# EasyEDA Pro project ProProject_Stc32f_Car副本_2024-06-03.epro, schematic 主板
Create Date: 2024-03-17; Page Name: 主板原理图; Project Name: Stc32f_Car; Schematic Name: 主板; Update Date: 2024-04-25; Company: 嘉立创EDA; Page Size: A4; Version: V1.0
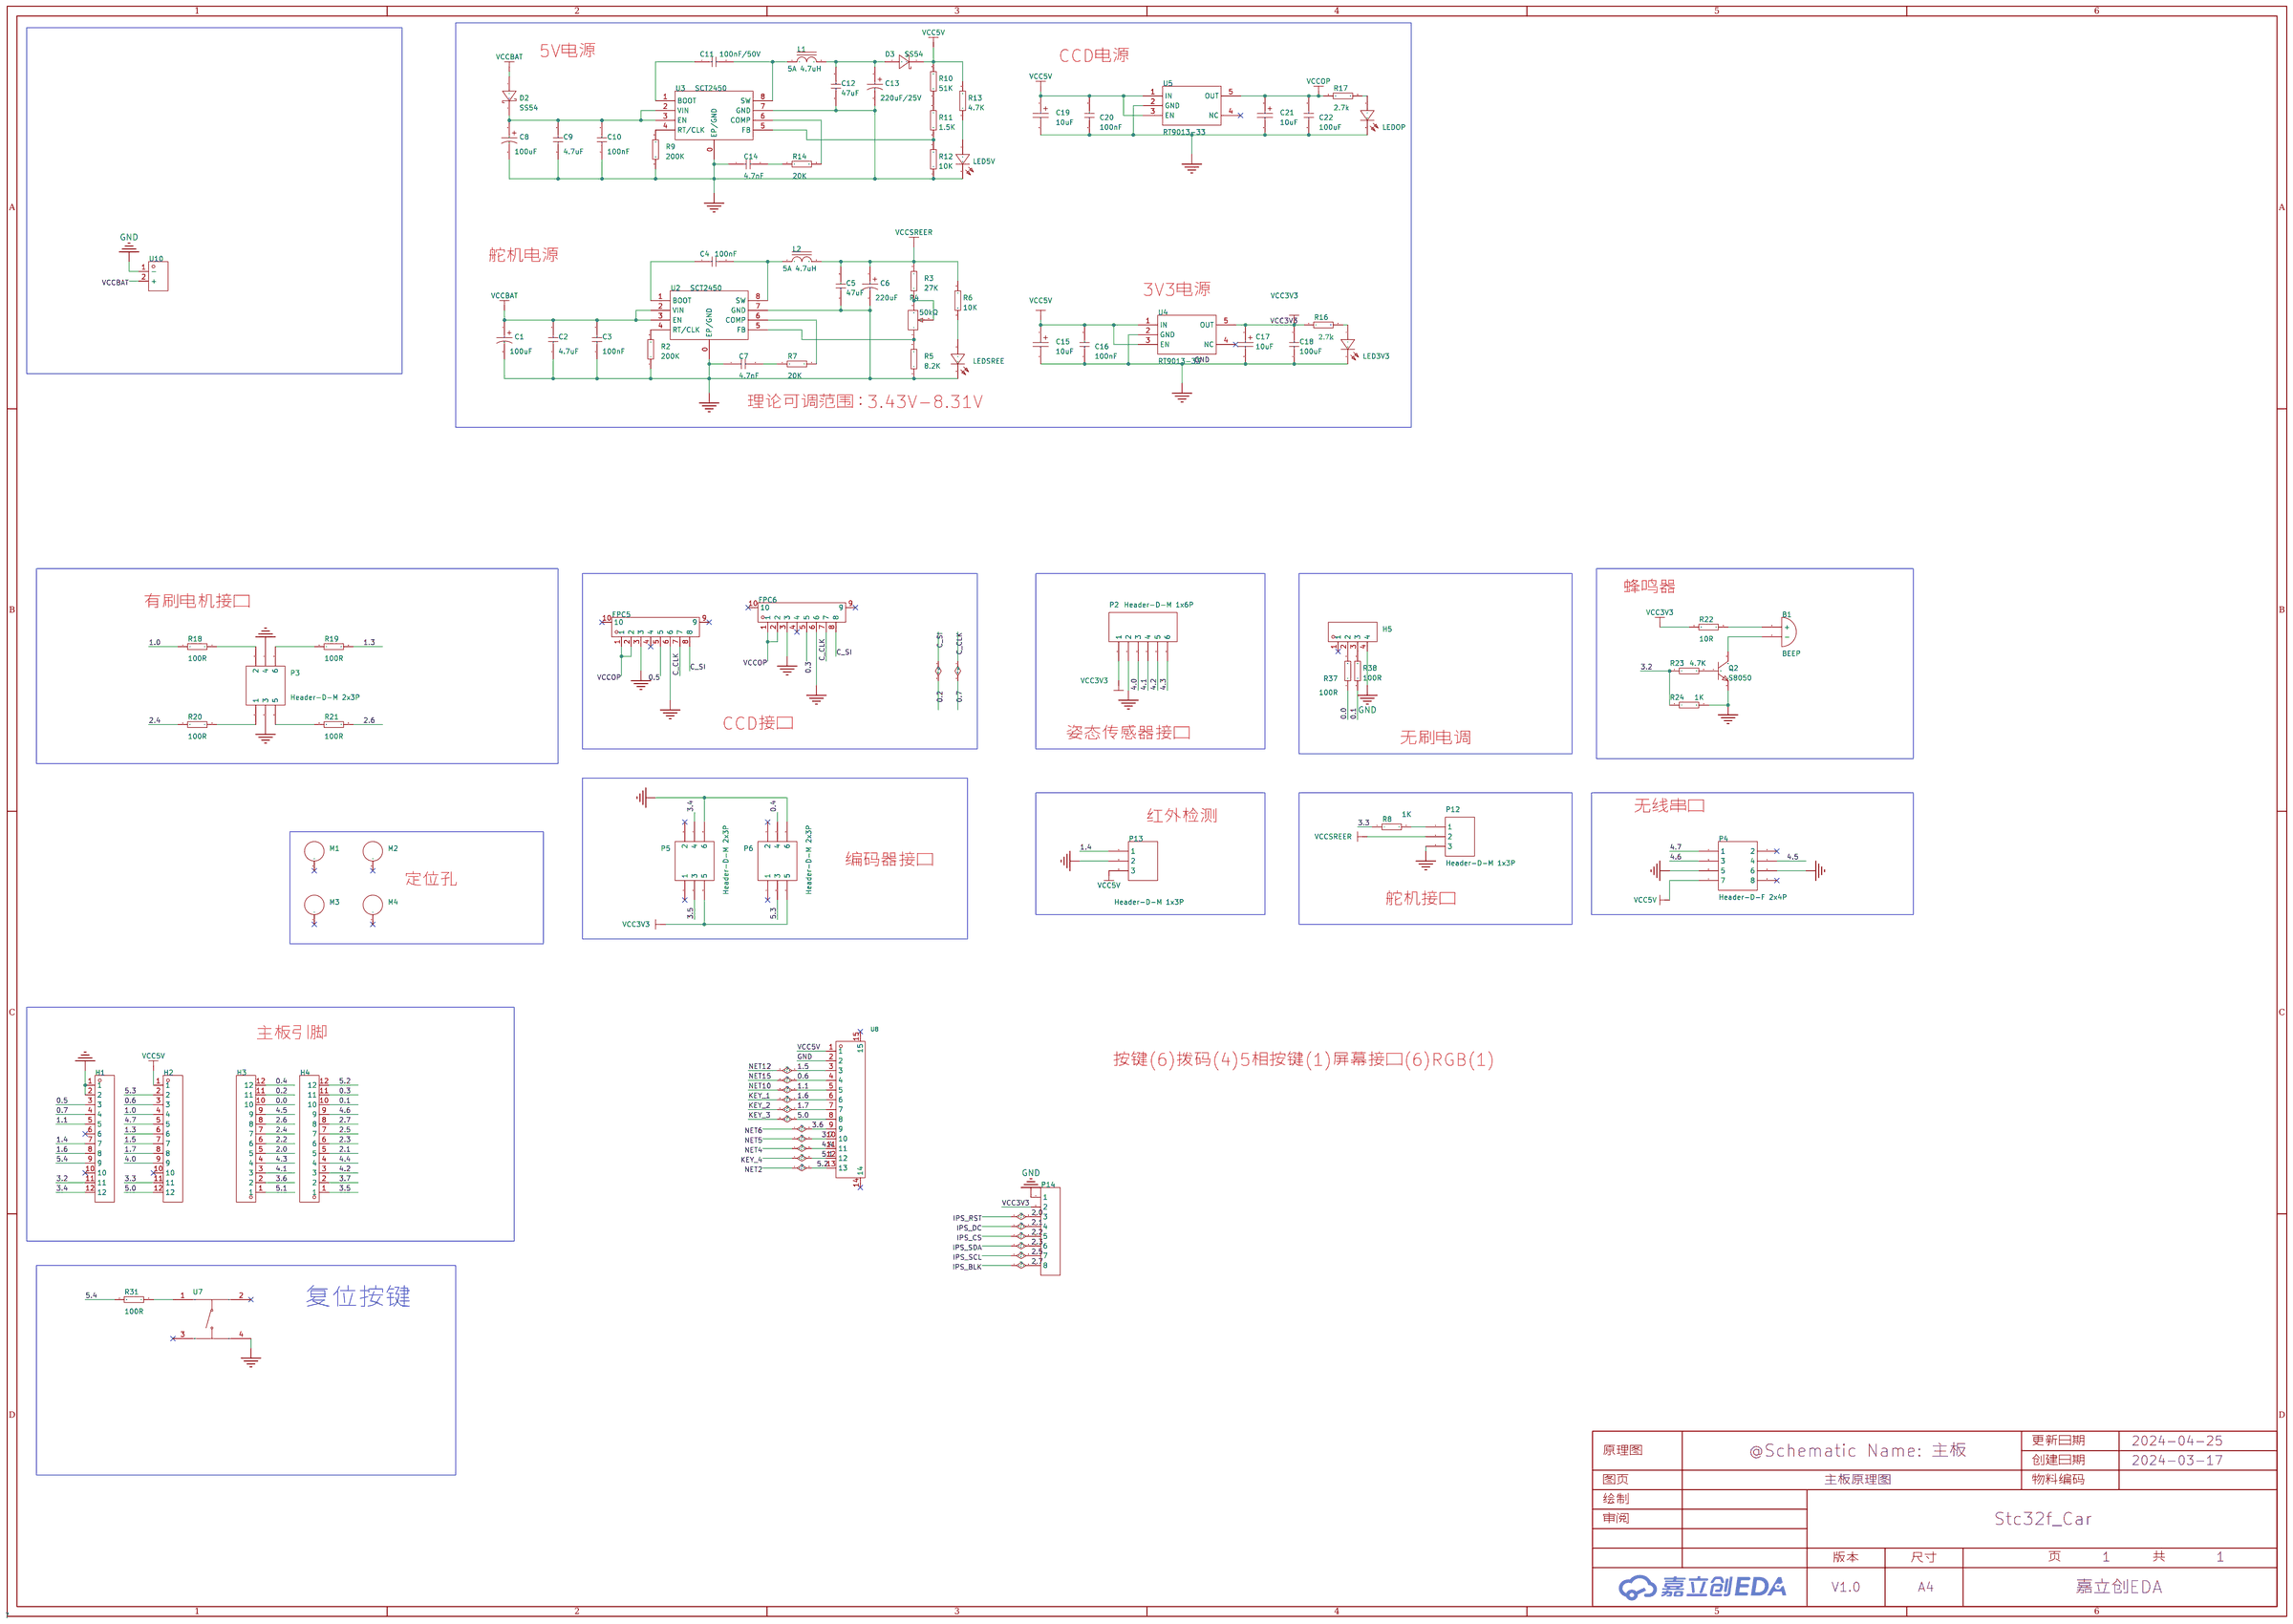
[diagram p10: schematic sheet]

## Parts
B1  BEEP  [BEEP 9x5.5mm]
C1  100uF  [CAP-E-S 6.3]
C2  4.7uF  [CAPC3216[1206]S]
C3  100nF  [CAPC1608[0603]S-N]
C4  100nF  [CAPC1608[0603]S-N]
C5  47uF  [CAPC3216[1206]S]
C6  220uF  [CAP-E-S 6.3]
C7  4.7nF  [CAPC1608[0603]S-N]
C8  100uF  [CAP-E-S 6.3]
C9  4.7uF  [CAPC3216[1206]S]
C10  100nF  [CAPC1608[0603]S-N]
C11  100nF  [CAPC1608[0603]S-N]
C12  47uF  [CAPC3216[1206]S]
C13  220uF  [CAP-E-S 6.3]
C14  4.7nF  [CAPC1608[0603]S-N]
C15  10uF  [CAP-T-S 3216]
C16  100nF  [CAPC1608[0603]S-N]
C17  10uF  [CAP-T-S 3216]
C18  100nF  [CAPC1608[0603]S-N]
C19  10uF  [CAP-T-S 3216]
C20  100nF  [CAPC1608[0603]S-N]
C21  10uF  [CAP-T-S 3216]
C22  100nF  [CAPC1608[0603]S-N]
D2  SS54  [SMA-L[DO-214AC]]
D3  SS54  [SMA-L[DO-214AC]]
FPC5  FPC-05F-8PH20  [FPC-SMD_8P-P0.50_FPC-05F-8PH20]
FPC6  FPC-05F-8PH20  [FPC-SMD_8P-P0.50_FPC-05F-8PH20]
H1  -  [HDR-TH_12P-P2.54-V-F]
H2  -  [HDR-TH_12P-P2.54-V-F]
H3  -  [HDR-TH_12P-P2.54-V-F]
H4  -  [HDR-TH_12P-P2.54-V-F]
H5  PZ254V-11-04P  [HDR-TH_4P-P2.54-V-M]
L1  4.7uH  [0630 TPC 7*7*3]
L2  4.7uH  [0630 TPC 7*7*3]
LED3V3  翠绿贴片LED  [LEDC1608(0603)-L]
LED5V  翠绿贴片LED  [LEDC1608(0603)-L]
LEDOP  翠绿贴片LED  [LEDC1608(0603)-L]
LEDSREE  翠绿贴片LED  [LEDC1608(0603)-L]
M1  MountHole  [M3-MountHole]
M2  MountHole  [M3-MountHole]
M3  MountHole  [M3-MountHole]
M4  MountHole  [M3-MountHole]
P2  Header-D-M 1x6P  [HDR1X6-M]
P3  Header-D-M 2x3P  [HDR2X3-M]
P4  Header-D-F 2x4P  [HDR2X4-F]
P5  Header-D-M 2x3P  [HDR2X3-M]
P6  Header-D-M 2x3P  [HDR2X3-M]
P12  Header-D-M 1x3P  [HDR1X3-M]
P13  Header-D-M 1x3P  [HDR1X3-M]
P14  2.54-1*8P母环保  [HDR-TH_8P-P2.54-V-F-1]
Q2  S8050  [SOT-23]
R2  200K  [RESC1608[0603]S-N]
R3  27K  [RESC1608[0603]S-N]
R4  50kΩ  [RES-ADJ-SMD_3224W]
R5  8.2K  [RESC1608[0603]S-N]
R6  10K  [RESC1608[0603]S-N]
R7  20K  [RESC1608[0603]S-N]
R8  1K  [RESC1608[0603]S-N]
R9  200K  [RESC1608[0603]S-N]
R10  51K  [RESC1608[0603]S-N]
R11  1.5K  [RESC1608[0603]S-N]
R12  10K  [RESC1608[0603]S-N]
R13  4.7K  [RESC1608[0603]S-N]
R14  20K  [RESC1608[0603]S-N]
R16  2.7K  [RESC1608[0603]S-N]
R17  2.7K  [RESC1608[0603]S-N]
R18  100R  [RESC1608[0603]S-N]
R19  100R  [RESC1608[0603]S-N]
R20  100R  [RESC1608[0603]S-N]
R21  100R  [RESC1608[0603]S-N]
R22  10R  [RESC1608[0603]S-N]
R23  4.7K  [RESC1608[0603]S-N]
R24  1K  [RESC1608[0603]S-N]
R31  100R  [RESC1608[0603]S-N]
R37  100R  [RESC1608[0603]S-N]
R38  100R  [RESC1608[0603]S-N]
U2  SCT2450  [SOP-8E]
U3  SCT2450  [SOP-8E]
U4  RT9013-33  [SOT-23-5]
U5  RT9013-33  [SOT-23-5]
U7  TS3425PA 250gf 098  [SW-SMD_4P-L4.2-W3.4-P2.15-LS5.2]
U8  AFD01-S13FCC-00  [FPC-SMD_13P-P0.50_AFD01-S13FCA--00]
U10  XT30U-F  [CONN-TH_XT30U-F]

## Library data of the parts
B1 = BEEP: Origin Footprint 2: BEEP 12x9.5mm
C1 C8 = E-S 100uF 35V 6.3x7.7: Revision: V1.0; Type: 铝电解; Voltage: 35V
C2 C9 = 4.7uF 1206 35V X5R: Revision: V1.0; Voltage: 35V; Type: X5R; Origin Footprint 2: CAPC3216[1206]
C3 C4 C10 C11 C16 C18 C20 C22 = 100nF 0603 50V X7R: Revision: V1.0; Voltage: 50V; Type: X7R; Origin Footprint 2: CAPC1608[0603]-L; Origin Footprint 3: CAPC1608[0603]-M; Origin Footprint 4: CAPC1608[0603]-N; Origin Footprint 5: CAPC1608[0603]S-L; Origin Footprint 6: CAPC1608[0603]S-M
C5 C12 = 47uF 1206 25V X5R: Revision: V1.0; Voltage: 25V; Type: X5R; Origin Footprint 2: CAPC3216[1206]
C6 C13 = E-S 220uF 25V 6.3x7.7: Revision: V1.0; Type: 铝电解; Voltage: 25V
C7 C14 = 4.7nF 0603 50V X7R: Revision: V1.0; Voltage: 50V; Type: X7R; Origin Footprint 2: CAPC1608[0603]-L; Origin Footprint 3: CAPC1608[0603]-M; Origin Footprint 4: CAPC1608[0603]-N; Origin Footprint 5: CAPC1608[0603]S-L; Origin Footprint 6: CAPC1608[0603]S-M
C15 C17 C19 C21 = T-S 10uF 3216 16V: Revision: July-2002: Re-released for DXP Platform.; Type: TanCap; Voltage: 16V
D2 D3 = SS54: Revision: V1.0
FPC5 FPC6 = FPC-05F-8PH20: 锁定特性:翻盖式;触点类型:下接;触点数量:8P;间距:0.5mm;安装类型:卧贴;工作温度范围:-25℃~+85℃;; LCSC Part Name: 间距:0.5mm P数:8P 翻盖式 下接; Supplier Part: C2856797; Manufacturer: XUNPU(讯普); Supplier Footprint: SMD,P=0.5mm,卧贴; JLCPCB Part Class: 扩展库; Datasheet: https://atta.szlcsc.com/upload/public/pdf/source/20210728/C2856796_EA80EFD10E16055FE067E7763B90421F.pdf; Supplier: LCSC; Locking Feature: 翻盖式; Contact Type: 下接; Number of Contacts: 8P; Pitch: 0.5mm; Mounting Type: 卧贴; FFC, FCB Thickness: 0.3mm; Height Above Board: 2mm; Operating Temperature Range: -25℃~+85℃
H1-H4 = HDR-F_2.54_1x12P: Supplier Part: C2905419; Supplier Footprint: 插件
H5 = PZ254V-11-04P: 插针结构:1x4P;间距:2.54mm;行距:-;圆针/方针:方针;安装类型:直插;排数:单排;总PIN位数:4P;额定电流:3A;额定电压:250V;配合针长度:6mm;塑高:2.5mm;端接针长度:3mm;触头材质:-;工作温度范围:-40℃~+105℃;颜色:黑色;; LCSC Part Name: 间距:2.54mm 1x4P 直插 方针; Supplier Part: C2691448; Manufacturer: XFCN(兴飞); Supplier Footprint: 插件,P=2.54mm; JLCPCB Part Class: 扩展库; Datasheet: https://atta.szlcsc.com/upload/public/pdf/source/20200309/C492403_F9F19131791D08044AD4F84F8E751A34.pdf; Supplier: LCSC; Pin Structure: 1x4P; Pitch: 2.54mm; Circluar Pins/Square Pins: 方针; Mounting Type: 直插; Number of Rows: 单排; Number of Pins: 4P; Current Rating (Max): 3A; Voltage Rating (Max): 250V; Length of Mating Pin: 6mm; Insulation Height: 2.5mm; Length of End Connection Pin: 3mm; Operating Temperature Range: -40℃~+105℃; Color: 黑色
L1 L2 = Ind-Power: Published: 8-Jun-2000; Revision: July-2002: Re-released for DXP Platform.; Publisher: Altium Limited; DCR: .5m; Price(RMB): 0.000; Imax: 5A; Origin Footprint 2: CD31; Origin Footprint 3: CD32; Origin Footprint 4: CD42; Origin Footprint 5: CD43; Origin Footprint 6: CD52; Origin Footprint 7: CD53; Origin Footprint 8: CD54; Origin Footprint 9: CD73; Origin Footprint 10: CD75; Origin Footprint 11: CD104; Origin Footprint 12: CD105; Origin Footprint 13: CD106; Origin Footprint 14: 127 Shielded 12.5*12.5*7; Origin Footprint 15: 1050 TPC 10*10*5; Origin Footprint 16: 1265 TPC 12*12*6.5; Origin Footprint 17: CD104R; Origin Footprint 18: SLO2520; Origin Footprint 19: 1365 TPC 13*13*6.5; Origin Footprint 20: INDUCTOR; Origin Footprint 21: 0402 TPC 4*4*2
LED3V3 LED5V LEDOP LEDSREE = LED Chip Green: Published: 8-Jun-2000; Revision: July-2002: Re-released for DXP Platform.; Publisher: Altium Limited; Price(RMB): 0.00; Origin Footprint 2: LEDC1608(0603); Origin Footprint 3: LEDC2012(0805); Origin Footprint 4: LEDC3216(1206); Origin Footprint 5: LEDC2012(0805)-L; Origin Footprint 6: LEDC3216(1204); Origin Footprint 7: LEDC3528-2
M1-M4 = MountHole: Origin Footprint 2: M3-MountSlot; Origin Footprint 3: M3-MountSlot-Plated; Origin Footprint 4: M3-MountHole-4mm; Origin Footprint 5: M3-MountHole-5mm; Origin Footprint 6: M3-MountHole-6mm; Origin Footprint 7: M3-MountHole-7mm; Origin Footprint 8: M3-MountHole-8mm; Origin Footprint 9: M3-MountHole-9mm; Origin Footprint 10: M3-MountHole-10mm; Origin Footprint 11: M3-MountHole-11mm; Origin Footprint 12: M3-MountHole-12mm; Origin Footprint 13: M3-MountHole-13mm; Origin Footprint 14: M3-MountHole-14mm; Origin Footprint 15: M3-MountHole-15mm; Origin Footprint 16: M3-MountHole-16mm; Origin Footprint 17: M3-MountHole-17mm; Origin Footprint 18: M3-MountHole-18mm; Origin Footprint 19: M3-MountHole-19mm; Origin Footprint 20: M3-MountHole-20mm; Origin Footprint 21: M3-MountHole-Plated-D5.2; Origin Footprint 22: M3-MountHole-Plated-D5.5; Origin Footprint 23: M3-MountHole-Plated-D6
P2 = Header-D-M 1x6P: Revision: V1.0
P3 P5 P6 = Header-D-M 2x3P: Revision: V1.0
P4 = Header-D-F 2x4P: Revision: V1.0
P12 P13 = Header-D-M 1x3P: Revision: V1.0
P14 = 2.54-1*8P母环保: 插孔结构:1x8P;间距:2.54mm;行距:-;安装类型:直插;排数:单排;总孔位数:8P;塑高:-;触头材质:-;触头镀层:-;; LCSC Part Name: 间距:2.54mm 1x8P 直插; Supplier Part: C27438; Manufacturer: BOOMELE(博穆精密); Supplier Footprint: 插件,P=2.54mm; JLCPCB Part Class: 扩展库; Datasheet: https://atta.szlcsc.com/upload/public/pdf/source/20231221/1CA800C6799ED97958773716FAA1BFFE.pdf; Supplier: LCSC; Holes Structure: 1x8P; Pitch: 2.54mm; Mounting Type: 直插; Number of Rows: 单排; Number of Holes: 8P
Q2 = NPN S8050: Published: 8-Jun-2000; Revision: July-2002: Re-released for DXP Platform.; Publisher: Altium Limited; Price(RMB): 0.000
R2 R9 = Res-Chip_1: Revision: V1.0; Power: 1/8W; Tolerance: ±1%; Origin Footprint 2: RESC0603[0201]-L; Origin Footprint 3: RESC0603[0201]-M; Origin Footprint 4: RESC0603[0201]-N; Origin Footprint 5: RESC0603[0201]S-L; Origin Footprint 6: RESC0603[0201]S-M; Origin Footprint 7: RESC0603[0201]S-N; Origin Footprint 8: RESC1005[0402]-L; Origin Footprint 9: RESC1005[0402]S-M; Origin Footprint 10: RESC1005[0402]-M; Origin Footprint 11: RESC1005[0402]-N; Origin Footprint 12: RESC1005[0402]S-L; Origin Footprint 13: RESC1005[0402]S-N; Origin Footprint 14: RESC1608[0603]-L; Origin Footprint 15: RESC1608[0603]-M; Origin Footprint 16: RESC1608[0603]-N; Origin Footprint 17: RESC1608[0603]S-L; Origin Footprint 18: RESC1608[0603]S-M; Origin Footprint 19: RESC2012[0805]; Origin Footprint 20: RESC2012[0805]S-L; Origin Footprint 21: RESC2012[0805]S-M; Origin Footprint 22: RESC2012[0805]S-N; Origin Footprint 23: RESC3216[1206]; Origin Footprint 24: RESC3216[1206]S-L; Origin Footprint 25: RESC3216[1206]S-M; Origin Footprint 26: RESC3216[1206]S-N; Origin Footprint 27: RESC3225[1210]; Origin Footprint 28: RESC3225[1210]S; Origin Footprint 29: RESC5025[2010]; Origin Footprint 30: RESC5025[2010]S; Origin Footprint 31: RESC6332[2512]; Origin Footprint 32: RESC6332[2512]S
R3 = Res-Chip_7: Revision: V1.0; Power: 1/8W; Tolerance: ±1%; Origin Footprint 2: RESC0603[0201]-L; Origin Footprint 3: RESC0603[0201]-M; Origin Footprint 4: RESC0603[0201]-N; Origin Footprint 5: RESC0603[0201]S-L; Origin Footprint 6: RESC0603[0201]S-M; Origin Footprint 7: RESC0603[0201]S-N; Origin Footprint 8: RESC1005[0402]-L; Origin Footprint 9: RESC1005[0402]S-M; Origin Footprint 10: RESC1005[0402]-M; Origin Footprint 11: RESC1005[0402]-N; Origin Footprint 12: RESC1005[0402]S-L; Origin Footprint 13: RESC1005[0402]S-N; Origin Footprint 14: RESC1608[0603]-L; Origin Footprint 15: RESC1608[0603]-M; Origin Footprint 16: RESC1608[0603]-N; Origin Footprint 17: RESC1608[0603]S-L; Origin Footprint 18: RESC1608[0603]S-M; Origin Footprint 19: RESC2012[0805]; Origin Footprint 20: RESC2012[0805]S-L; Origin Footprint 21: RESC2012[0805]S-M; Origin Footprint 22: RESC2012[0805]S-N; Origin Footprint 23: RESC3216[1206]; Origin Footprint 24: RESC3216[1206]S-L; Origin Footprint 25: RESC3216[1206]S-M; Origin Footprint 26: RESC3216[1206]S-N; Origin Footprint 27: RESC3225[1210]; Origin Footprint 28: RESC3225[1210]S; Origin Footprint 29: RESC5025[2010]; Origin Footprint 30: RESC5025[2010]S; Origin Footprint 31: RESC6332[2512]; Origin Footprint 32: RESC6332[2512]S
R4 = 3224W-1-503E: 阻值:50kΩ;精度:±10%;功率:250mW;温度系数:±100ppm/℃;; LCSC Part Name: 50kΩ ±10%; Supplier Part: C48484; Manufacturer: BOURNS; Supplier Footprint: SMD; JLCPCB Part Class: 扩展库; Datasheet: https://atta.szlcsc.com/upload/public/pdf/source/20160830/1472551532733.pdf; Supplier: LCSC; Tolerance: ±10%; Power(Watts): 250mW; Temperature Coefficient: ±100ppm/℃; Turns: 12
R5 = Res-Chip_8: Revision: V1.0; Power: 1/8W; Tolerance: ±1%; Origin Footprint 2: RESC0603[0201]-L; Origin Footprint 3: RESC0603[0201]-M; Origin Footprint 4: RESC0603[0201]-N; Origin Footprint 5: RESC0603[0201]S-L; Origin Footprint 6: RESC0603[0201]S-M; Origin Footprint 7: RESC0603[0201]S-N; Origin Footprint 8: RESC1005[0402]-L; Origin Footprint 9: RESC1005[0402]S-M; Origin Footprint 10: RESC1005[0402]-M; Origin Footprint 11: RESC1005[0402]-N; Origin Footprint 12: RESC1005[0402]S-L; Origin Footprint 13: RESC1005[0402]S-N; Origin Footprint 14: RESC1608[0603]-L; Origin Footprint 15: RESC1608[0603]-M; Origin Footprint 16: RESC1608[0603]-N; Origin Footprint 17: RESC1608[0603]S-L; Origin Footprint 18: RESC1608[0603]S-M; Origin Footprint 19: RESC2012[0805]; Origin Footprint 20: RESC2012[0805]S-L; Origin Footprint 21: RESC2012[0805]S-M; Origin Footprint 22: RESC2012[0805]S-N; Origin Footprint 23: RESC3216[1206]; Origin Footprint 24: RESC3216[1206]S-L; Origin Footprint 25: RESC3216[1206]S-M; Origin Footprint 26: RESC3216[1206]S-N; Origin Footprint 27: RESC3225[1210]; Origin Footprint 28: RESC3225[1210]S; Origin Footprint 29: RESC5025[2010]; Origin Footprint 30: RESC5025[2010]S; Origin Footprint 31: RESC6332[2512]; Origin Footprint 32: RESC6332[2512]S
R6 R12 = Res-Chip: Revision: V1.0; Power: 1/8W; Tolerance: ±1%; Origin Footprint 2: RESC0603[0201]-L; Origin Footprint 3: RESC0603[0201]-M; Origin Footprint 4: RESC0603[0201]-N; Origin Footprint 5: RESC0603[0201]S-L; Origin Footprint 6: RESC0603[0201]S-M; Origin Footprint 7: RESC0603[0201]S-N; Origin Footprint 8: RESC1005[0402]-L; Origin Footprint 9: RESC1005[0402]S-M; Origin Footprint 10: RESC1005[0402]-M; Origin Footprint 11: RESC1005[0402]-N; Origin Footprint 12: RESC1005[0402]S-L; Origin Footprint 13: RESC1005[0402]S-N; Origin Footprint 14: RESC1608[0603]-L; Origin Footprint 15: RESC1608[0603]-M; Origin Footprint 16: RESC1608[0603]-N; Origin Footprint 17: RESC1608[0603]S-L; Origin Footprint 18: RESC1608[0603]S-M; Origin Footprint 19: RESC2012[0805]; Origin Footprint 20: RESC2012[0805]S-L; Origin Footprint 21: RESC2012[0805]S-M; Origin Footprint 22: RESC2012[0805]S-N; Origin Footprint 23: RESC3216[1206]; Origin Footprint 24: RESC3216[1206]S-L; Origin Footprint 25: RESC3216[1206]S-M; Origin Footprint 26: RESC3216[1206]S-N; Origin Footprint 27: RESC3225[1210]; Origin Footprint 28: RESC3225[1210]S; Origin Footprint 29: RESC5025[2010]; Origin Footprint 30: RESC5025[2010]S; Origin Footprint 31: RESC6332[2512]; Origin Footprint 32: RESC6332[2512]S
R7 R14 = Res-Chip_4: Revision: V1.0; Power: 1/8W; Tolerance: ±1%; Origin Footprint 2: RESC0603[0201]-L; Origin Footprint 3: RESC0603[0201]-M; Origin Footprint 4: RESC0603[0201]-N; Origin Footprint 5: RESC0603[0201]S-L; Origin Footprint 6: RESC0603[0201]S-M; Origin Footprint 7: RESC0603[0201]S-N; Origin Footprint 8: RESC1005[0402]-L; Origin Footprint 9: RESC1005[0402]S-M; Origin Footprint 10: RESC1005[0402]-M; Origin Footprint 11: RESC1005[0402]-N; Origin Footprint 12: RESC1005[0402]S-L; Origin Footprint 13: RESC1005[0402]S-N; Origin Footprint 14: RESC1608[0603]-L; Origin Footprint 15: RESC1608[0603]-M; Origin Footprint 16: RESC1608[0603]-N; Origin Footprint 17: RESC1608[0603]S-L; Origin Footprint 18: RESC1608[0603]S-M; Origin Footprint 19: RESC2012[0805]; Origin Footprint 20: RESC2012[0805]S-L; Origin Footprint 21: RESC2012[0805]S-M; Origin Footprint 22: RESC2012[0805]S-N; Origin Footprint 23: RESC3216[1206]; Origin Footprint 24: RESC3216[1206]S-L; Origin Footprint 25: RESC3216[1206]S-M; Origin Footprint 26: RESC3216[1206]S-N; Origin Footprint 27: RESC3225[1210]; Origin Footprint 28: RESC3225[1210]S; Origin Footprint 29: RESC5025[2010]; Origin Footprint 30: RESC5025[2010]S; Origin Footprint 31: RESC6332[2512]; Origin Footprint 32: RESC6332[2512]S
R8 R24 = Res-Chip_11: Revision: V1.0; Power: 1/8W; Tolerance: ±1%; Origin Footprint 2: RESC0603[0201]-L; Origin Footprint 3: RESC0603[0201]-M; Origin Footprint 4: RESC0603[0201]-N; Origin Footprint 5: RESC0603[0201]S-L; Origin Footprint 6: RESC0603[0201]S-M; Origin Footprint 7: RESC0603[0201]S-N; Origin Footprint 8: RESC1005[0402]-L; Origin Footprint 9: RESC1005[0402]S-M; Origin Footprint 10: RESC1005[0402]-M; Origin Footprint 11: RESC1005[0402]-N; Origin Footprint 12: RESC1005[0402]S-L; Origin Footprint 13: RESC1005[0402]S-N; Origin Footprint 14: RESC1608[0603]-L; Origin Footprint 15: RESC1608[0603]-M; Origin Footprint 16: RESC1608[0603]-N; Origin Footprint 17: RESC1608[0603]S-L; Origin Footprint 18: RESC1608[0603]S-M; Origin Footprint 19: RESC2012[0805]; Origin Footprint 20: RESC2012[0805]S-L; Origin Footprint 21: RESC2012[0805]S-M; Origin Footprint 22: RESC2012[0805]S-N; Origin Footprint 23: RESC3216[1206]; Origin Footprint 24: RESC3216[1206]S-L; Origin Footprint 25: RESC3216[1206]S-M; Origin Footprint 26: RESC3216[1206]S-N; Origin Footprint 27: RESC3225[1210]; Origin Footprint 28: RESC3225[1210]S; Origin Footprint 29: RESC5025[2010]; Origin Footprint 30: RESC5025[2010]S; Origin Footprint 31: RESC6332[2512]; Origin Footprint 32: RESC6332[2512]S
R10 = Res-Chip_2: Revision: V1.0; Power: 1/8W; Tolerance: ±1%; Origin Footprint 2: RESC0603[0201]-L; Origin Footprint 3: RESC0603[0201]-M; Origin Footprint 4: RESC0603[0201]-N; Origin Footprint 5: RESC0603[0201]S-L; Origin Footprint 6: RESC0603[0201]S-M; Origin Footprint 7: RESC0603[0201]S-N; Origin Footprint 8: RESC1005[0402]-L; Origin Footprint 9: RESC1005[0402]S-M; Origin Footprint 10: RESC1005[0402]-M; Origin Footprint 11: RESC1005[0402]-N; Origin Footprint 12: RESC1005[0402]S-L; Origin Footprint 13: RESC1005[0402]S-N; Origin Footprint 14: RESC1608[0603]-L; Origin Footprint 15: RESC1608[0603]-M; Origin Footprint 16: RESC1608[0603]-N; Origin Footprint 17: RESC1608[0603]S-L; Origin Footprint 18: RESC1608[0603]S-M; Origin Footprint 19: RESC2012[0805]; Origin Footprint 20: RESC2012[0805]S-L; Origin Footprint 21: RESC2012[0805]S-M; Origin Footprint 22: RESC2012[0805]S-N; Origin Footprint 23: RESC3216[1206]; Origin Footprint 24: RESC3216[1206]S-L; Origin Footprint 25: RESC3216[1206]S-M; Origin Footprint 26: RESC3216[1206]S-N; Origin Footprint 27: RESC3225[1210]; Origin Footprint 28: RESC3225[1210]S; Origin Footprint 29: RESC5025[2010]; Origin Footprint 30: RESC5025[2010]S; Origin Footprint 31: RESC6332[2512]; Origin Footprint 32: RESC6332[2512]S
R11 = Res-Chip_5: Revision: V1.0; Power: 1/8W; Tolerance: ±1%; Origin Footprint 2: RESC0603[0201]-L; Origin Footprint 3: RESC0603[0201]-M; Origin Footprint 4: RESC0603[0201]-N; Origin Footprint 5: RESC0603[0201]S-L; Origin Footprint 6: RESC0603[0201]S-M; Origin Footprint 7: RESC0603[0201]S-N; Origin Footprint 8: RESC1005[0402]-L; Origin Footprint 9: RESC1005[0402]S-M; Origin Footprint 10: RESC1005[0402]-M; Origin Footprint 11: RESC1005[0402]-N; Origin Footprint 12: RESC1005[0402]S-L; Origin Footprint 13: RESC1005[0402]S-N; Origin Footprint 14: RESC1608[0603]-L; Origin Footprint 15: RESC1608[0603]-M; Origin Footprint 16: RESC1608[0603]-N; Origin Footprint 17: RESC1608[0603]S-L; Origin Footprint 18: RESC1608[0603]S-M; Origin Footprint 19: RESC2012[0805]; Origin Footprint 20: RESC2012[0805]S-L; Origin Footprint 21: RESC2012[0805]S-M; Origin Footprint 22: RESC2012[0805]S-N; Origin Footprint 23: RESC3216[1206]; Origin Footprint 24: RESC3216[1206]S-L; Origin Footprint 25: RESC3216[1206]S-M; Origin Footprint 26: RESC3216[1206]S-N; Origin Footprint 27: RESC3225[1210]; Origin Footprint 28: RESC3225[1210]S; Origin Footprint 29: RESC5025[2010]; Origin Footprint 30: RESC5025[2010]S; Origin Footprint 31: RESC6332[2512]; Origin Footprint 32: RESC6332[2512]S
R13 R23 = Res-Chip_3: Revision: V1.0; Power: 1/8W; Tolerance: ±1%; Origin Footprint 2: RESC0603[0201]-L; Origin Footprint 3: RESC0603[0201]-M; Origin Footprint 4: RESC0603[0201]-N; Origin Footprint 5: RESC0603[0201]S-L; Origin Footprint 6: RESC0603[0201]S-M; Origin Footprint 7: RESC0603[0201]S-N; Origin Footprint 8: RESC1005[0402]-L; Origin Footprint 9: RESC1005[0402]S-M; Origin Footprint 10: RESC1005[0402]-M; Origin Footprint 11: RESC1005[0402]-N; Origin Footprint 12: RESC1005[0402]S-L; Origin Footprint 13: RESC1005[0402]S-N; Origin Footprint 14: RESC1608[0603]-L; Origin Footprint 15: RESC1608[0603]-M; Origin Footprint 16: RESC1608[0603]-N; Origin Footprint 17: RESC1608[0603]S-L; Origin Footprint 18: RESC1608[0603]S-M; Origin Footprint 19: RESC2012[0805]; Origin Footprint 20: RESC2012[0805]S-L; Origin Footprint 21: RESC2012[0805]S-M; Origin Footprint 22: RESC2012[0805]S-N; Origin Footprint 23: RESC3216[1206]; Origin Footprint 24: RESC3216[1206]S-L; Origin Footprint 25: RESC3216[1206]S-M; Origin Footprint 26: RESC3216[1206]S-N; Origin Footprint 27: RESC3225[1210]; Origin Footprint 28: RESC3225[1210]S; Origin Footprint 29: RESC5025[2010]; Origin Footprint 30: RESC5025[2010]S; Origin Footprint 31: RESC6332[2512]; Origin Footprint 32: RESC6332[2512]S
R16 R17 = Res-Chip_6: Revision: V1.0; Power: 1/8W; Tolerance: ±1%; Origin Footprint 2: RESC0603[0201]-L; Origin Footprint 3: RESC0603[0201]-M; Origin Footprint 4: RESC0603[0201]-N; Origin Footprint 5: RESC0603[0201]S-L; Origin Footprint 6: RESC0603[0201]S-M; Origin Footprint 7: RESC0603[0201]S-N; Origin Footprint 8: RESC1005[0402]-L; Origin Footprint 9: RESC1005[0402]S-M; Origin Footprint 10: RESC1005[0402]-M; Origin Footprint 11: RESC1005[0402]-N; Origin Footprint 12: RESC1005[0402]S-L; Origin Footprint 13: RESC1005[0402]S-N; Origin Footprint 14: RESC1608[0603]-L; Origin Footprint 15: RESC1608[0603]-M; Origin Footprint 16: RESC1608[0603]-N; Origin Footprint 17: RESC1608[0603]S-L; Origin Footprint 18: RESC1608[0603]S-M; Origin Footprint 19: RESC2012[0805]; Origin Footprint 20: RESC2012[0805]S-L; Origin Footprint 21: RESC2012[0805]S-M; Origin Footprint 22: RESC2012[0805]S-N; Origin Footprint 23: RESC3216[1206]; Origin Footprint 24: RESC3216[1206]S-L; Origin Footprint 25: RESC3216[1206]S-M; Origin Footprint 26: RESC3216[1206]S-N; Origin Footprint 27: RESC3225[1210]; Origin Footprint 28: RESC3225[1210]S; Origin Footprint 29: RESC5025[2010]; Origin Footprint 30: RESC5025[2010]S; Origin Footprint 31: RESC6332[2512]; Origin Footprint 32: RESC6332[2512]S
R18-R21 R31 R37 R38 = Res-Chip_9: Revision: V1.0; Power: 1/8W; Tolerance: ±1%; Origin Footprint 2: RESC0603[0201]-L; Origin Footprint 3: RESC0603[0201]-M; Origin Footprint 4: RESC0603[0201]-N; Origin Footprint 5: RESC0603[0201]S-L; Origin Footprint 6: RESC0603[0201]S-M; Origin Footprint 7: RESC0603[0201]S-N; Origin Footprint 8: RESC1005[0402]-L; Origin Footprint 9: RESC1005[0402]S-M; Origin Footprint 10: RESC1005[0402]-M; Origin Footprint 11: RESC1005[0402]-N; Origin Footprint 12: RESC1005[0402]S-L; Origin Footprint 13: RESC1005[0402]S-N; Origin Footprint 14: RESC1608[0603]-L; Origin Footprint 15: RESC1608[0603]-M; Origin Footprint 16: RESC1608[0603]-N; Origin Footprint 17: RESC1608[0603]S-L; Origin Footprint 18: RESC1608[0603]S-M; Origin Footprint 19: RESC2012[0805]; Origin Footprint 20: RESC2012[0805]S-L; Origin Footprint 21: RESC2012[0805]S-M; Origin Footprint 22: RESC2012[0805]S-N; Origin Footprint 23: RESC3216[1206]; Origin Footprint 24: RESC3216[1206]S-L; Origin Footprint 25: RESC3216[1206]S-M; Origin Footprint 26: RESC3216[1206]S-N; Origin Footprint 27: RESC3225[1210]; Origin Footprint 28: RESC3225[1210]S; Origin Footprint 29: RESC5025[2010]; Origin Footprint 30: RESC5025[2010]S; Origin Footprint 31: RESC6332[2512]; Origin Footprint 32: RESC6332[2512]S
R22 = Res-Chip_10: Revision: V1.0; Power: 1/8W; Tolerance: ±1%; Origin Footprint 2: RESC0603[0201]-L; Origin Footprint 3: RESC0603[0201]-M; Origin Footprint 4: RESC0603[0201]-N; Origin Footprint 5: RESC0603[0201]S-L; Origin Footprint 6: RESC0603[0201]S-M; Origin Footprint 7: RESC0603[0201]S-N; Origin Footprint 8: RESC1005[0402]-L; Origin Footprint 9: RESC1005[0402]S-M; Origin Footprint 10: RESC1005[0402]-M; Origin Footprint 11: RESC1005[0402]-N; Origin Footprint 12: RESC1005[0402]S-L; Origin Footprint 13: RESC1005[0402]S-N; Origin Footprint 14: RESC1608[0603]-L; Origin Footprint 15: RESC1608[0603]-M; Origin Footprint 16: RESC1608[0603]-N; Origin Footprint 17: RESC1608[0603]S-L; Origin Footprint 18: RESC1608[0603]S-M; Origin Footprint 19: RESC2012[0805]; Origin Footprint 20: RESC2012[0805]S-L; Origin Footprint 21: RESC2012[0805]S-M; Origin Footprint 22: RESC2012[0805]S-N; Origin Footprint 23: RESC3216[1206]; Origin Footprint 24: RESC3216[1206]S-L; Origin Footprint 25: RESC3216[1206]S-M; Origin Footprint 26: RESC3216[1206]S-N; Origin Footprint 27: RESC3225[1210]; Origin Footprint 28: RESC3225[1210]S; Origin Footprint 29: RESC5025[2010]; Origin Footprint 30: RESC5025[2010]S; Origin Footprint 31: RESC6332[2512]; Origin Footprint 32: RESC6332[2512]S
U2 U3 = SP1N28STER: Revision: V1.0
U4 U5 = RT9013-33
U7 = TS3425PA 250gf 098: 电路结构:单刀单掷;按钮形状:椭圆形按钮;作用力:160gf;安装方式:立贴;开关长度:4mm;开关宽度:3mm;开关高度:2.5mm;带支架:不带;触点电流:50mA;额定电压(DC):12V;额定功率:0.6W;绝缘电阻:100MΩ;带灯:无;机械寿命:10万次;; LCSC Part Name: 电子烟轻触开关3*4*2.5mm 平脚3.4*4.2*2.5mm  250gf; Supplier Part: C5363474; Manufacturer: SHOU HAN(首韩); Supplier Footprint: SMD; JLCPCB Part Class: 扩展库; Datasheet: https://atta.szlcsc.com/upload/public/pdf/source/20230224/8E2DED868FB52CBA25EDBDE418AA439A.pdf; Supplier: LCSC; Circuit: 单刀单掷; Actuator Style: 椭圆形按钮; Operating Force: 160gf; Mounting Style: 立贴; Switch Length: 4mm; Switch Width: 3mm; Switch Height: 2.5mm; Strike Gundam: 不带; Contact Current: 50mA; Voltage Rating (DC): 12V; Power Rating: 0.6W; Insulation Resistance: 100MΩ; Actuator/Cap Color: 白色; With Lamp: 无; Mechanical Life: 10万次; Operating Temperature: -20℃~+80℃
U8 = AFD01-S13FCC-00: 锁定特性:翻盖式;触点类型:下接;触点数量:13P;间距:0.5mm;安装类型:卧贴;; LCSC Part Name: 间距:0.5mm P数:13P 翻盖式 下接; Supplier Part: C18198486; Manufacturer: JS(钜硕电子); Supplier Footprint: SMD,P=0.5mm,卧贴; Datasheet: https://atta.szlcsc.com/upload/public/pdf/source/20230921/C984413AEFF3A883511B509B58F9A1F7.pdf; Supplier: LCSC; Locking Feature: 翻盖式; Contact Type: 下接; Number of Contacts: 13P; Pitch: 0.5mm; Mounting Type: 卧贴; Height Above Board: 2mm
U10 = XT30U-F: 类别:-;类型1:-;; LCSC Part Name: AMASS(艾迈斯)轻量版锂电池插头母头 XT30U-F; Supplier Part: C99102; Manufacturer: AMASS(艾迈斯); JLCPCB Part Class: 扩展库; Datasheet: https://atta.szlcsc.com/upload/public/pdf/source/20190916/C428721_B0ECB8C5937139CEFE8736D2D3175B0E.pdf; Supplier: LCSC; Brand: 艾迈斯; Type: 插头; Colour: 黄色; InterfaceType: 母头

## Nets
GND: C1.2 C2.1 C3.1 C5.1 C6.2 C7.1 C8.2 C9.1 C10.1 C12.1 C13.2 C14.1 C15.2 C16.1 C17.2 C18.1 C19.2 C20.1 C21.2 C22.1 FPC5.3 FPC5.6 FPC6.3 FPC6.6 H1.1 H1.2 H5.4 LED3V3.C LED5V.C LEDOP.C LEDSREE.C P2.2 P3.3 P3.4 P4.5 P4.6 P5.6 P6.6 P12.3 P13.2 P14.1 Q2.2(E) R2.1 R5.1 R9.1 R12.1 R24.2 U2.0(EP/GND) U2.7(GND) U3.0(EP/GND) U3.7(GND) U4.2(GND) U5.2(GND) U7.4 U8.2 U10.1(-)
VCC3V3: C17.1 C18.2 P2.1 P5.5 P6.5 P14.2 R16.1 R22.1 U4.5(OUT)
VCC5V: C15.1 C16.2 C19.1 C20.2 D3.K H2.1 P4.7 P13.3 R10.2 R13.2 U4.1(IN) U4.3(EN) U5.1(IN) U5.3(EN) U8.1
VCCBAT: C1.1 C2.2 C3.2 D2.A U2.2(VIN) U2.3(EN) U10.2(+)
VCCOP: C21.1 C22.2 FPC5.1 FPC5.2 FPC6.1 FPC6.2 R17.1 U5.5(OUT)
VCCSREER: C5.2 C6.1 L2.2 P12.2 R3.2 R6.2
0.0: H3.10 R37.1
0.1: H4.10 R38.1
0.2: FPC5.8 FPC6.8 H3.11
0.3: FPC6.5 H4.11
0.4: H3.12 P6.4
0.5: FPC5.5 H1.3
0.6: H2.3 U8.4
0.7: FPC5.7 FPC6.7 H1.4
1.0: H2.4 R18.1
1.1: H1.5 U8.5
1.3: H2.6 R19.2
1.4: H1.7 P13.1
1.5: H2.7 U8.3
1.6: H1.8 U8.6
1.7: H2.8 U8.7
2.0: H3.5 P14.3
2.1: H4.5 P14.4
2.2: H3.6 P14.5
2.3: H4.6 P14.6
2.4: H3.7 R20.1
2.5: H4.7 P14.7
2.6: H3.8 R21.2
2.7: H4.8 P14.8
3.2: H1.11 R23.1 R24.1
3.3: H2.11 R8.1
3.4: H1.12 P5.4
3.5: H4.1 P5.3
3.6: H3.2 U8.9
3.7: H4.2 U8.10
4.0: H2.9 P2.3
4.1: H3.3 P2.4
4.2: H4.3 P2.5
4.3: H3.4 P2.6
4.4: H4.4 U8.11
4.5: H3.9 P4.4
4.6: H4.9 P4.3
4.7: H2.5 P4.1
5.0: H2.12 U8.8
5.1: H3.1 U8.12
5.2: H4.12 U8.13
5.3: H2.2 P6.3
5.4: H1.9 R31.1
$1N2042: LED3V3.A R16.2
$1N2956: R2.2 U2.4(RT/CLK)
$1N3101: C7.2 R7.1
$1N3696: C4.1 U2.1(BOOT)
$1N3703: C4.2 L2.1 U2.8(SW)
$1N3886: LEDSREE.A R6.1
$1N3932: R4.1 R5.2 U2.5(FB)
$1N3984: R7.2 U2.6(COMP)
$1N4029: R3.1 R4.2 R4.3
$1N4662: C8.1 C9.2 C10.2 D2.K U3.2(VIN) U3.3(EN)
$1N4691: R9.2 U3.4(RT/CLK)
$1N4693: C14.2 R14.1
$1N4695: C11.1 U3.1(BOOT)
$1N4698: C11.2 L1.1 U3.8(SW)
$1N4710: LED5V.A R13.1
$1N4712: R11.1 R12.2 U3.5(FB)
$1N4716: R14.2 U3.6(COMP)
$1N5455: R10.1 R11.2
$1N9162: LEDOP.A R17.2
$1N9799: P3.2 R18.2
$1N9802: P3.6 R19.1
$1N9804: P3.1 R20.2
$1N9806: P3.5 R21.1
$1N10309: B1.1(+) R22.2
$1N10311: Q2.1(B) R23.2
$1N10315: B1.2(-) Q2.3(C)
$1N12210: P12.1 R8.2
$1N13487: C12.2 C13.1 D3.A L1.2
$1N95017: R31.2 U7.1
$1N95167: H5.2 R37.2
$1N95319: H5.3 R38.2

Not connected (* = marked no-connect by the designer): FPC5 4* 9* 10*; FPC6 4* 9* 10*; H1 6* 10*; H2 10*; H5 1*; M1 1*; M2 1*; M3 1*; M4 1*; P4 2* 8*; P5 1* 2*; P6 1* 2*; U4 4(NC)*; U5 4(NC)*; U7 2* 3*; U8 14* 15*

## Notes on the sheet
- 5V电源
- CCD电源
- 舵机电源
- 3V3电源
- 理论可调范围：3.43V-8.31V
- 蜂鸣器
- 有刷电机接口
- CCD接口
- 姿态传感器接口
- 无刷电调
- 无线串口
- 红外检测
- 编码器接口
- 定位孔
- 舵机接口
- 主板引脚
- 按键(6)拨码(4)5相按键(1)屏幕接口(6)RGB(1)
- 复位按键
